# EasyEDA schematic SCH_SEEK-998-001_v1_00.json
TITLE: SEEK-998-001 Shield for XBee to RYLR998; REV: 1.00; Date: 2023-02-13; Sheet: 1/1; Drawn By: c4m0ufl4g3; Company: Injectyll-HIDe
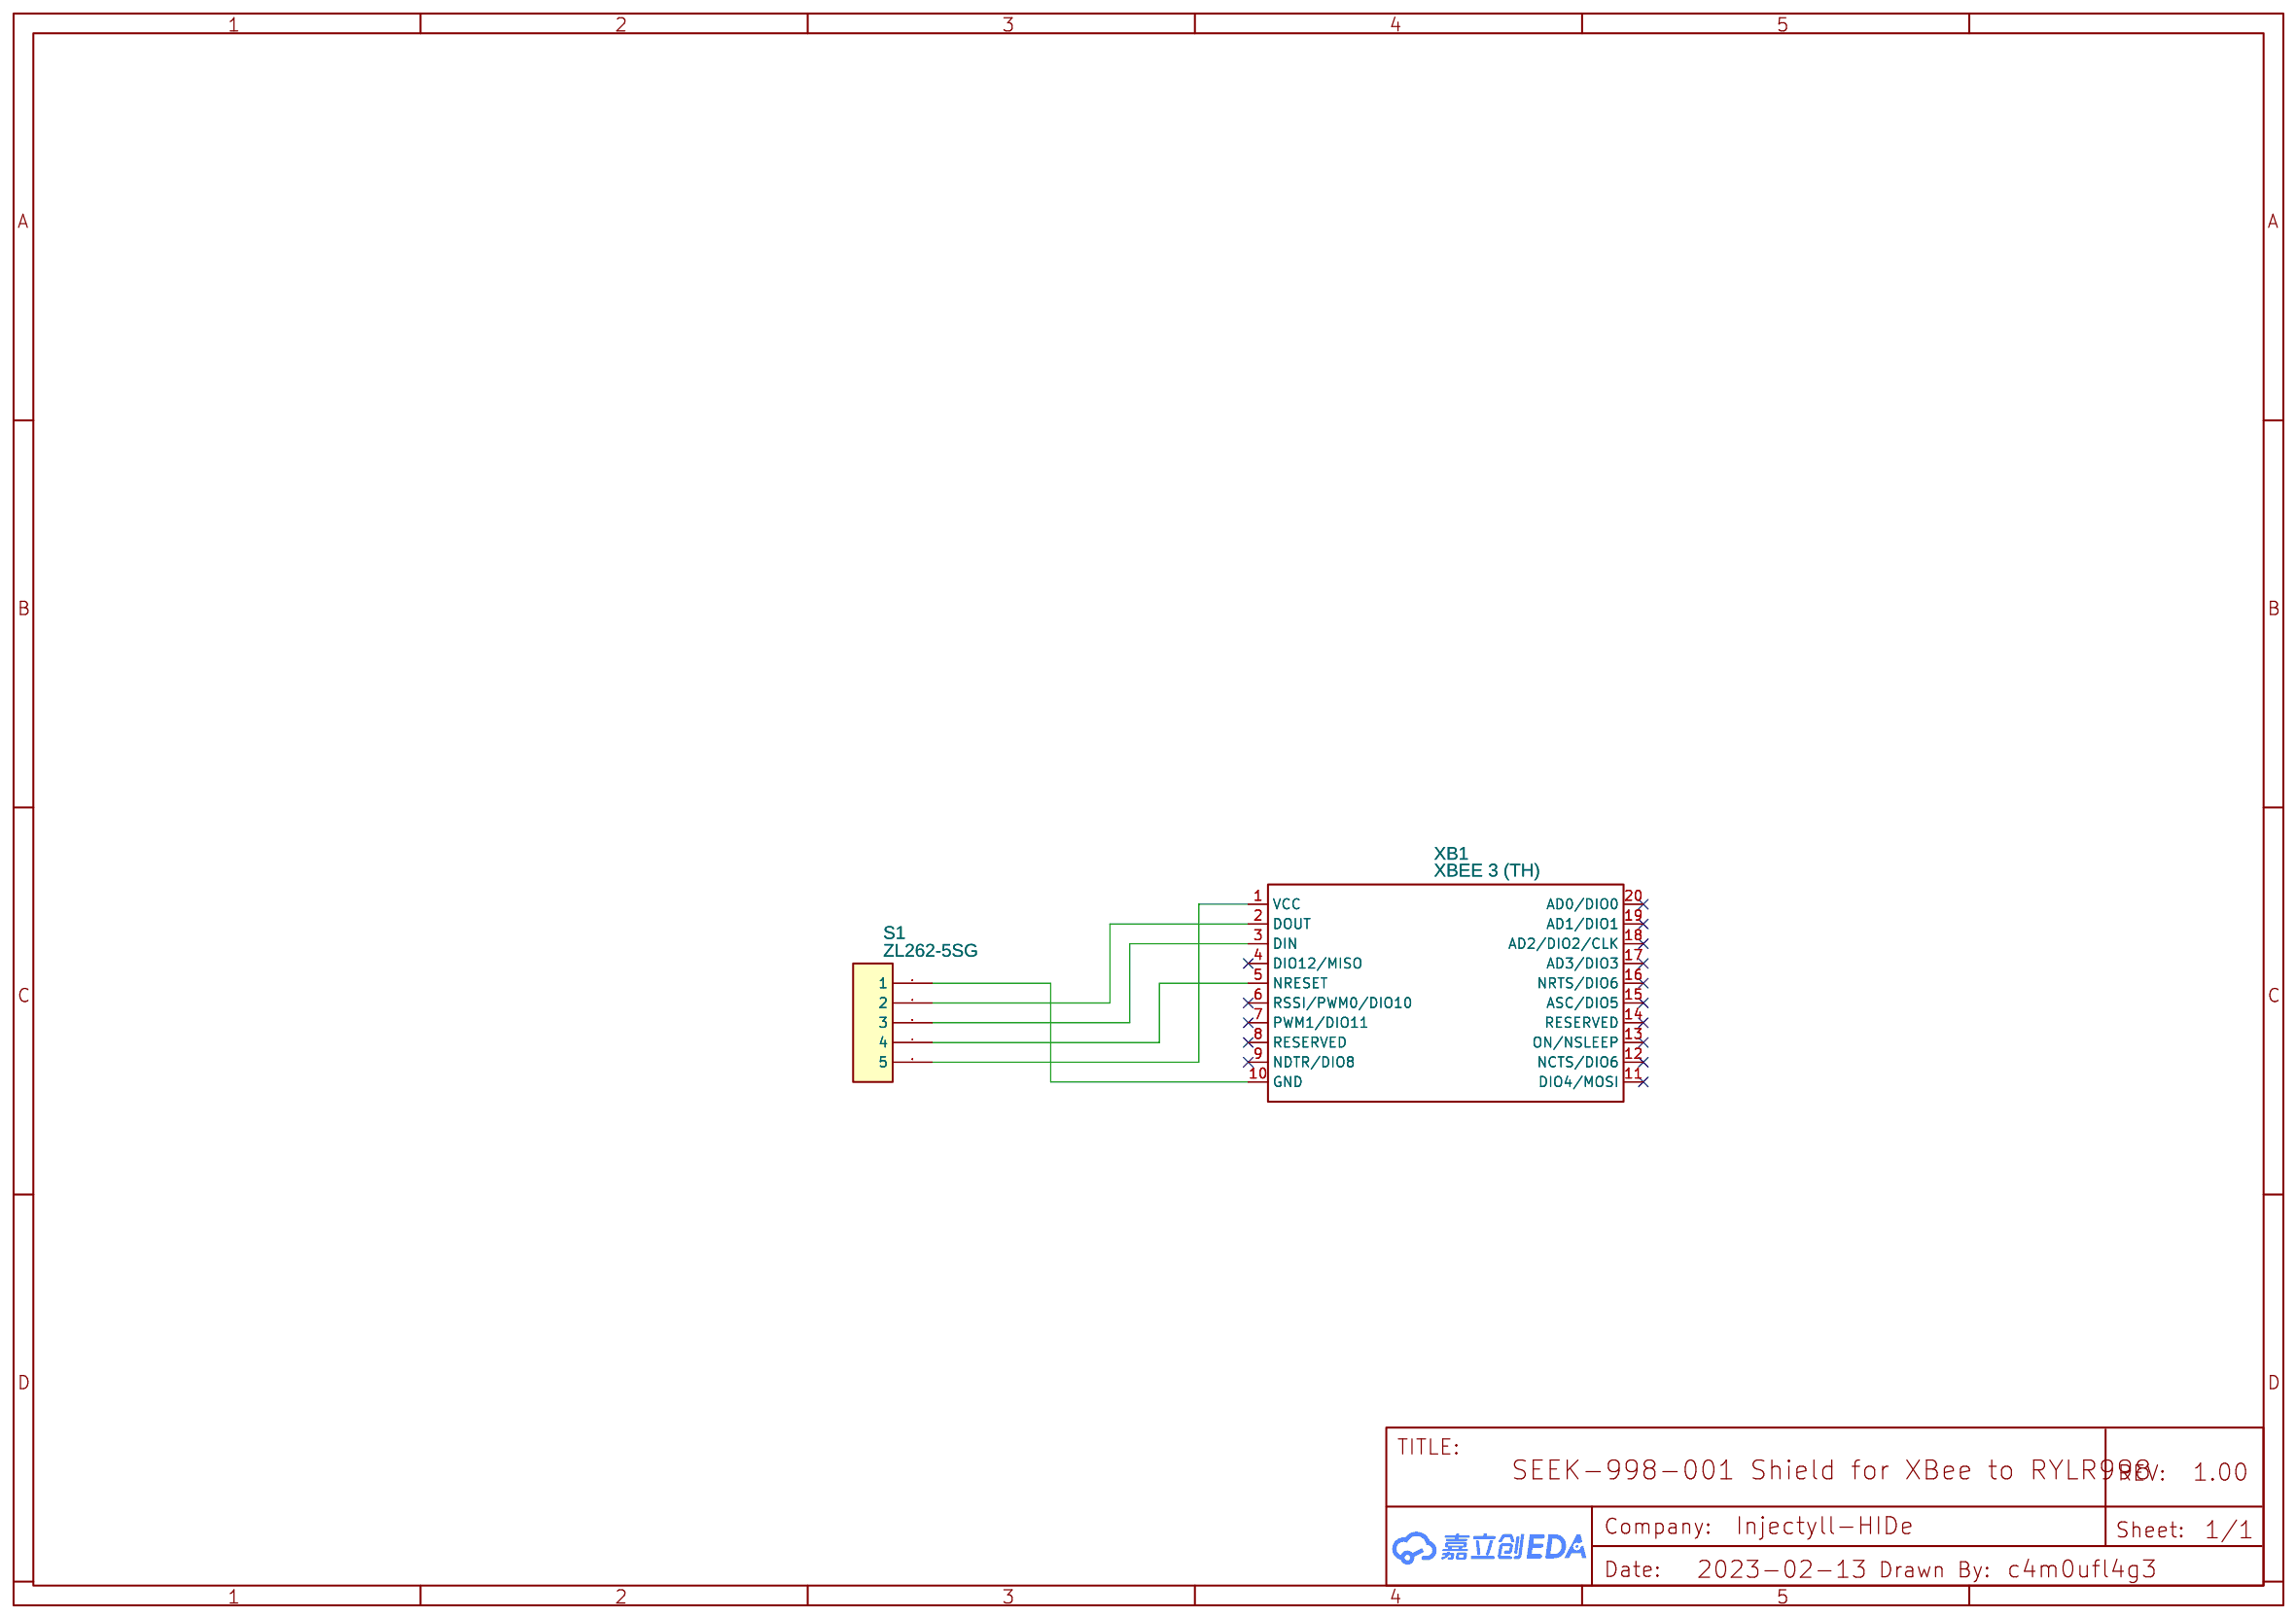
[diagram p0: schematic sheet]

## Parts
S1  ZL262-5SG  [HEADER 1X5 FEMALE AG4]
XB1  XBEE 3 (TH)  [XBEE 3 (TH)]

## Library data of the parts
S1 = ZL262-5SG: Contributor: AndrzejGeciow
XB1 = XBEE 3 (TH): Manufacturer: Digi; link: https://www.digi.com/products/embedded-systems/digi-xbee/rf-modules/2-4-ghz-rf-modules/xbee3-zigbee-3#productsupport; Contributor: MEBenz

## Nets
Net-(S1-1): S1.1 XB1.10(GND)
Net-(S1-2): S1.2 XB1.2(DOUT)
Net-(S1-3): S1.3 XB1.3(DIN)
Net-(S1-4): S1.4 XB1.5(NRESET)
Net-(S1-5): S1.5 XB1.1(VCC)

Not connected (* = marked no-connect by the designer): XB1 4(DIO12/MISO)* 6(RSSI/PWM0/DIO10)* 7(PWM1/DIO11)* 8(RESERVED)* 9(NDTR/DIO8)* 11(DIO4/MOSI)* 12(NCTS/DIO6)* 13(ON/NSLEEP)* 14(RESERVED)* 15(ASC/DIO5)* 16(NRTS/DIO6)* 17(AD3/DIO3)* 18(AD2/DIO2/CLK)* 19(AD1/DIO1)* 20(AD0/DIO0)*
